# Altium schematic sheet 01_Power.SchDoc
size A4
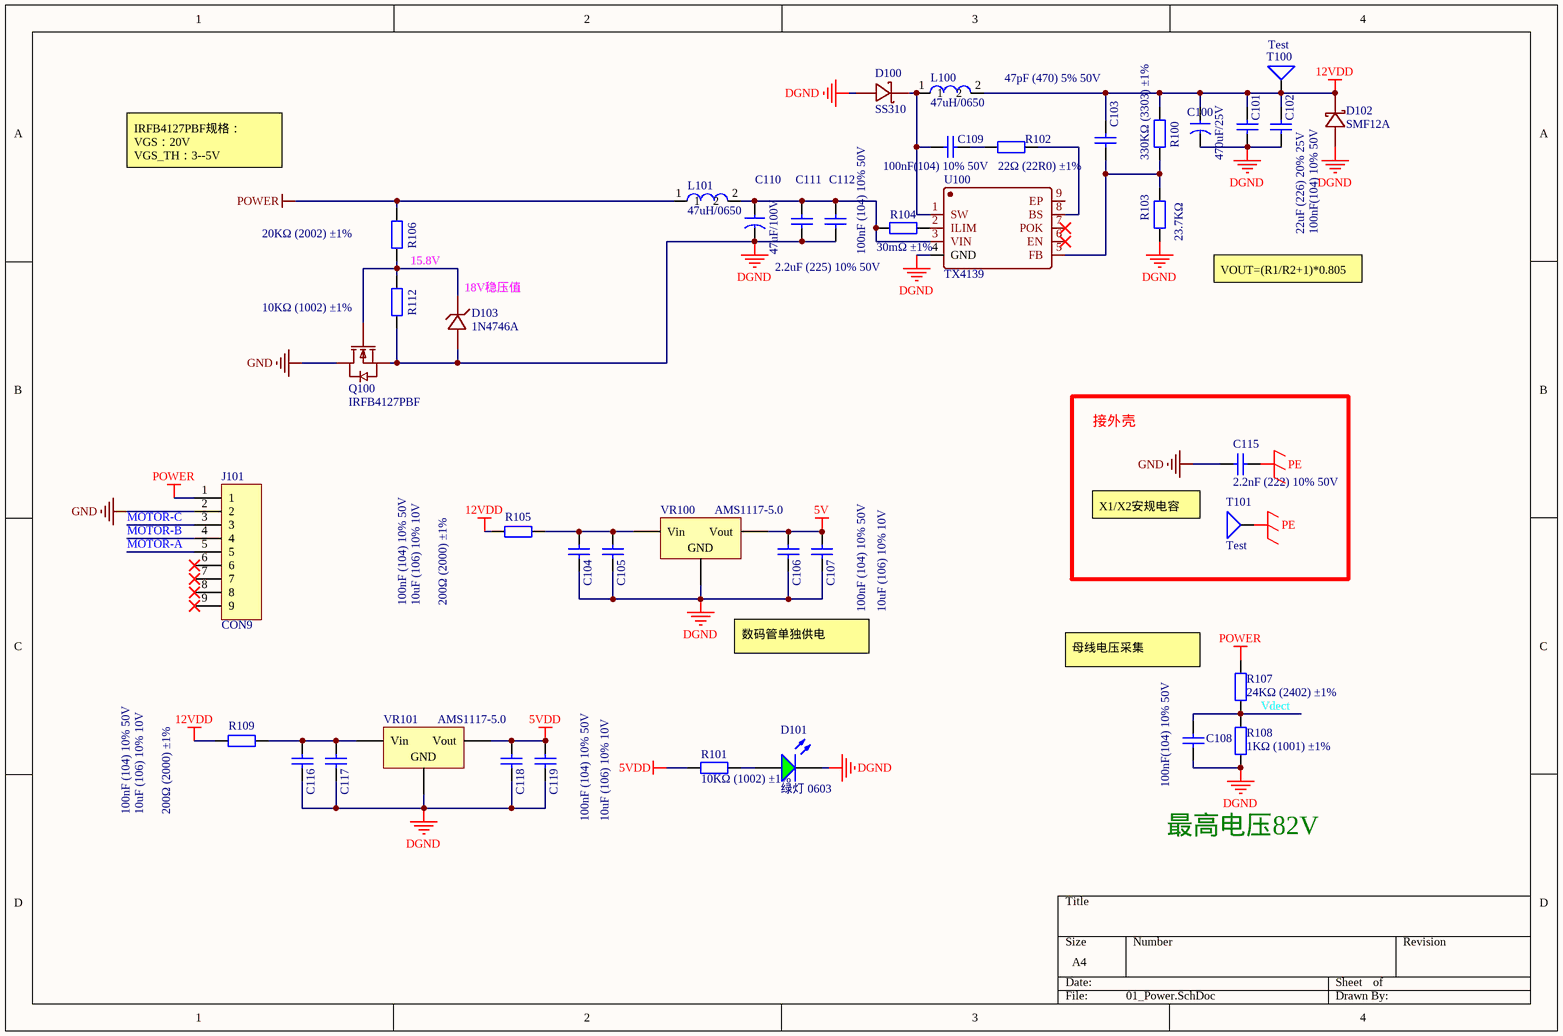
[diagram p0: 01_Power.SchDoc]

## Parts
C100  470uF/25V  [47UF/100V]
C101  22uF (226) 20% 25V  [0805_C]
C102  100nF(104) 10% 50V  [0805_C]
C103  47pF (470) 5% 50V  [0805_C]
C104  100nF (104) 10% 50V  [0603_C]
C105  10uF (106) 10% 10V  [0603_C]
C106  100nF (104) 10% 50V  [0603_C]
C107  10uF (106) 10% 10V  [0603_C]
C108  100nF(104) 10% 50V  [0805_C]
C109  100nF(104) 10% 50V  [0805_C]
C110  47uF/100V  [47UF/100V]
C111  2.2uF (225) 10% 50V  [1206_C]
C112  100nF (104) 10% 50V  [1206_C]
C115  2.2nF (222) 10% 50V  [X1/Y1 500V]
C116  100nF (104) 10% 50V  [0603_C]
C117  10uF (106) 10% 10V  [0603_C]
C118  100nF (104) 10% 50V  [0603_C]
C119  10uF (106) 10% 10V  [0603_C]
D100  SS310  [SS310]
D101  绿灯 0603  [0603_LED_S1]
D102  SMF12A  [SMF12A - duplicate]
D103  1N4746A  [1N4746A]
J101  CON9  [CON9 9.5mm]
L100  47uH/0650  [0650_47uH]
L101  47uH/0650  [0650_47uH]
Q100  IRFB4127PBF  [IRFB4127]
R100  330KΩ (3303) ±1%  [0805_R]
R101  10KΩ (1002) ±1%  [0603_R]
R102  22Ω (22R0) ±1%  [0805_R]
R103  23.7KΩ  [0805_R]
R104  30mΩ ±1%  [0603_R]
R105  200Ω (2000) ±1%  [1206_R]
R106  20KΩ (2002) ±1%  [0805_R]
R107  24KΩ (2402) ±1%  [1206_R]
R108  1KΩ (1001) ±1%  [0805_R]
R109  200Ω (2000) ±1%  [1206_R]
R112  10KΩ (1002) ±1%  [0805_R]
T100  Test  [Testpoint]
T101  Test  [接地螺丝孔]
U100  TX4139  [ESOP8]
VR100  AMS1117-5.0  [SOT-223]
VR101  AMS1117-5.0  [SOT-223]

## Blocks framed on the sheet
接外壳: C115 T101

## Nets
5V: C106.2 C107.2 VR100.2(Vout)
5VDD: C118.2 C119.2 R101.2 VR101.2(Vout)
12VDD: C100.1 C101.2 C102.2 C103.2 D102.1(K) L100.2 R100.2 R105.1 R109.1 T100.1
DGND: C100.2 C101.1 C102.1 C104.1 C105.1 C106.1 C107.1 C108.1 C110.2 C111.1 C112.1 C116.1 C117.1 C118.1 C119.1 D100.2(A) D101.K D102.2(A) D103.1(A) Q100.3(S) R103.1 R108.1 R112.1 U100.4(GND) VR100.1(GND) VR101.1(GND)
GND: C115.1 J101.2 Q100.2(D)
PE: C115.2 T101.1
POWER: J101.1 L101.1 R106.2 R107.2
MOTOR-A: J101.5
MOTOR-B: J101.4
MOTOR-C: J101.3
Vdect: C108.2 R107.1 R108.2
NetC103_1: C103.1 R100.1 R103.2 U100.5(FB)
NetC104_2: C104.2 C105.2 R105.2 VR100.3(Vin)
NetC109_1: C109.1 D100.1(K) L100.1 U100.1(SW)
NetC109_2: C109.2 R102.1
NetC110_1: C110.1 C111.2 C112.2 L101.2 R104.2 U100.3(VIN)
NetC116_2: C116.2 C117.2 R109.2 VR101.3(Vin)
NetD101_A: D101.A R101.1
NetD103_2: D103.2(K) Q100.1(G) R106.1 R112.2
NetR102_2: R102.2 U100.8(BS)
NetR104_1: R104.1 U100.2(ILIM)

Not connected (* = marked no-connect by the designer): J101 6* 7* 8* 9*; U100 6(EN)* 7(POK)* 9(EP)

## Notes on the sheet
- IRFB4127PBF规格：
  VGS：20V
  VGS_TH：3--5V
- 15.8V
- (near D103) 18V稳压值
- VOUT=(R1/R2+1)*0.805
- X1/X2安规电容
- 数码管单独供电
- (near R107) 母线电压采集
- 最高电压82V

## Library data of the parts
C100 C110 = CapSMT220u_16V
C101 = 0805 22uF (226) 20% 25V: 贴片电容; ComponentLink1Description: 供应商链接; ComponentLink1URL: http://www.szlcsc.com/product/details_46786.html; Package: 0805; Supplier: LC; SuppliersPartNumber: C45783
C102 C108 C109 = 0805 100nF(104) 10% 50V: 贴片电容; ComponentLink1Description: 供应商链接; ComponentLink1URL: http://www.szlcsc.com/product/details_50686.html; Package: 0805; Supplier: LC; SuppliersPartNumber: C49678
C103 = 0805 47pF (470) 5% 50V: 贴片电容; ComponentLink1Description: 供应商链接; ComponentLink1URL: http://www.szlcsc.com/product/details_15529.html; Package: 0805; Supplier: LC; SuppliersPartNumber: C14857
C104 C106 C116 C118 = 0603 100nF (104) 10% 50V: 贴片电容; ComponentLink1Description: 供应商链接; ComponentLink1URL: http://www.szlcsc.com/product/details_15331.html; Package: 0603; Supplier: LC; SuppliersPartNumber: C14663
C105 C107 C117 C119 = 0603 10uF (106) 10% 10V: 贴片电容; ComponentLink1Description: 供应商链接; ComponentLink1URL: http://www.szlcsc.com/product/details_20411.html; Package: 0603; Supplier: LC; SuppliersPartNumber: C19702
C111 = 1206 2.2uF (225) 10% 50V: 贴片电容; ComponentLink1Description: 供应商链接; ComponentLink1URL: http://www.szlcsc.com/product/details_13292.html; Package: 1206; Supplier: LC; SuppliersPartNumber: C12656
C112 = 1206 100nF (104) 10% 50V: 贴片电容; ComponentLink1Description: 供应商链接; ComponentLink1URL: http://www.szlcsc.com/product/details_25237.html; Package: 1206; Supplier: LC; SuppliersPartNumber: C24497
C115 = 0603 2.2nF (222) 10% 50V: 贴片电容; ComponentLink1Description: 供应商链接; ComponentLink1URL: http://www.szlcsc.com/product/details_1956.html; Package: 0603; Supplier: LC; SuppliersPartNumber: C1604
D101 = 0603 绿灯: 发光二极管; ComponentLink1Description: 供应商链接; ComponentLink1URL: http://www.szlcsc.com/product/details_73152.html; Package: 0603; Supplier: LC; SuppliersPartNumber: C72043
L100 L101 = Inductor
R100 = 0805 330KΩ (3303) 1%: 贴片电阻; ComponentLink1Description: 供应商链接; ComponentLink1URL: http://www.szlcsc.com/product/details_18317.html; Package: 0805; Supplier: LC; SuppliersPartNumber: C17629
R101 = 0603 10KΩ (1002) 1%: 贴片电阻; ComponentLink1Description: 供应商链接; ComponentLink1URL: http://www.szlcsc.com/product/details_26547.html; Package: 0603; Supplier: LC; SuppliersPartNumber: C25804
R102 R103 = 0805 22Ω (22R0) 1%: 贴片电阻; ComponentLink1Description: 供应商链接; ComponentLink1URL: http://www.szlcsc.com/product/details_18249.html; Package: 0805; Supplier: LC; SuppliersPartNumber: C17561
R104 = 0603 100KΩ (1003) 1%: 贴片电阻; ComponentLink1Description: 供应商链接; ComponentLink1URL: http://www.szlcsc.com/product/details_26546.html; Package: 0603; Supplier: LC; SuppliersPartNumber: C25803
R105 R109 = 1206 300Ω (3000) 1%: 贴片电阻; ComponentLink1Description: 供应商链接; ComponentLink1URL: http://www.szlcsc.com/product/details_18575.html; Package: 1206; Supplier: LC; SuppliersPartNumber: C17887
R106 = 0805 20KΩ (2002) 1%: 贴片电阻; ComponentLink1Description: 供应商链接; ComponentLink1URL: http://www.szlcsc.com/product/details_4735.html; Package: 0805; Supplier: LC; SuppliersPartNumber: C4328
R107 = 1206 0Ω (0R0) 1%: 贴片电阻; ComponentLink1Description: 供应商链接; ComponentLink1URL: http://www.szlcsc.com/product/details_18576.html; Package: 1206; Supplier: LC; SuppliersPartNumber: C17888
R108 = 0805 1KΩ (1001) 1%: 贴片电阻; ComponentLink1Description: 供应商链接; ComponentLink1URL: http://www.szlcsc.com/product/details_18201.html; Package: 0805; Supplier: LC; SuppliersPartNumber: C17513
R112 = 0805 10KΩ (1002) 1%: 贴片电阻; ComponentLink1Description: 供应商链接; ComponentLink1URL: http://www.szlcsc.com/product/details_18102.html; Package: 0805; Supplier: LC; SuppliersPartNumber: C17414
T100 T101 = TestPad
VR100 VR101 = SOT-223 AMS1117-5.0: 低压差线性稳压(LDO); ComponentLink1Description: 供应商链接; ComponentLink1URL: http://www.szlcsc.com/product/details_6653.html; Package: SOT-223; Supplier: LC; SuppliersPartNumber: C6187